# EAGLE schematic 14145^2 (EAGLE 7.5.0)
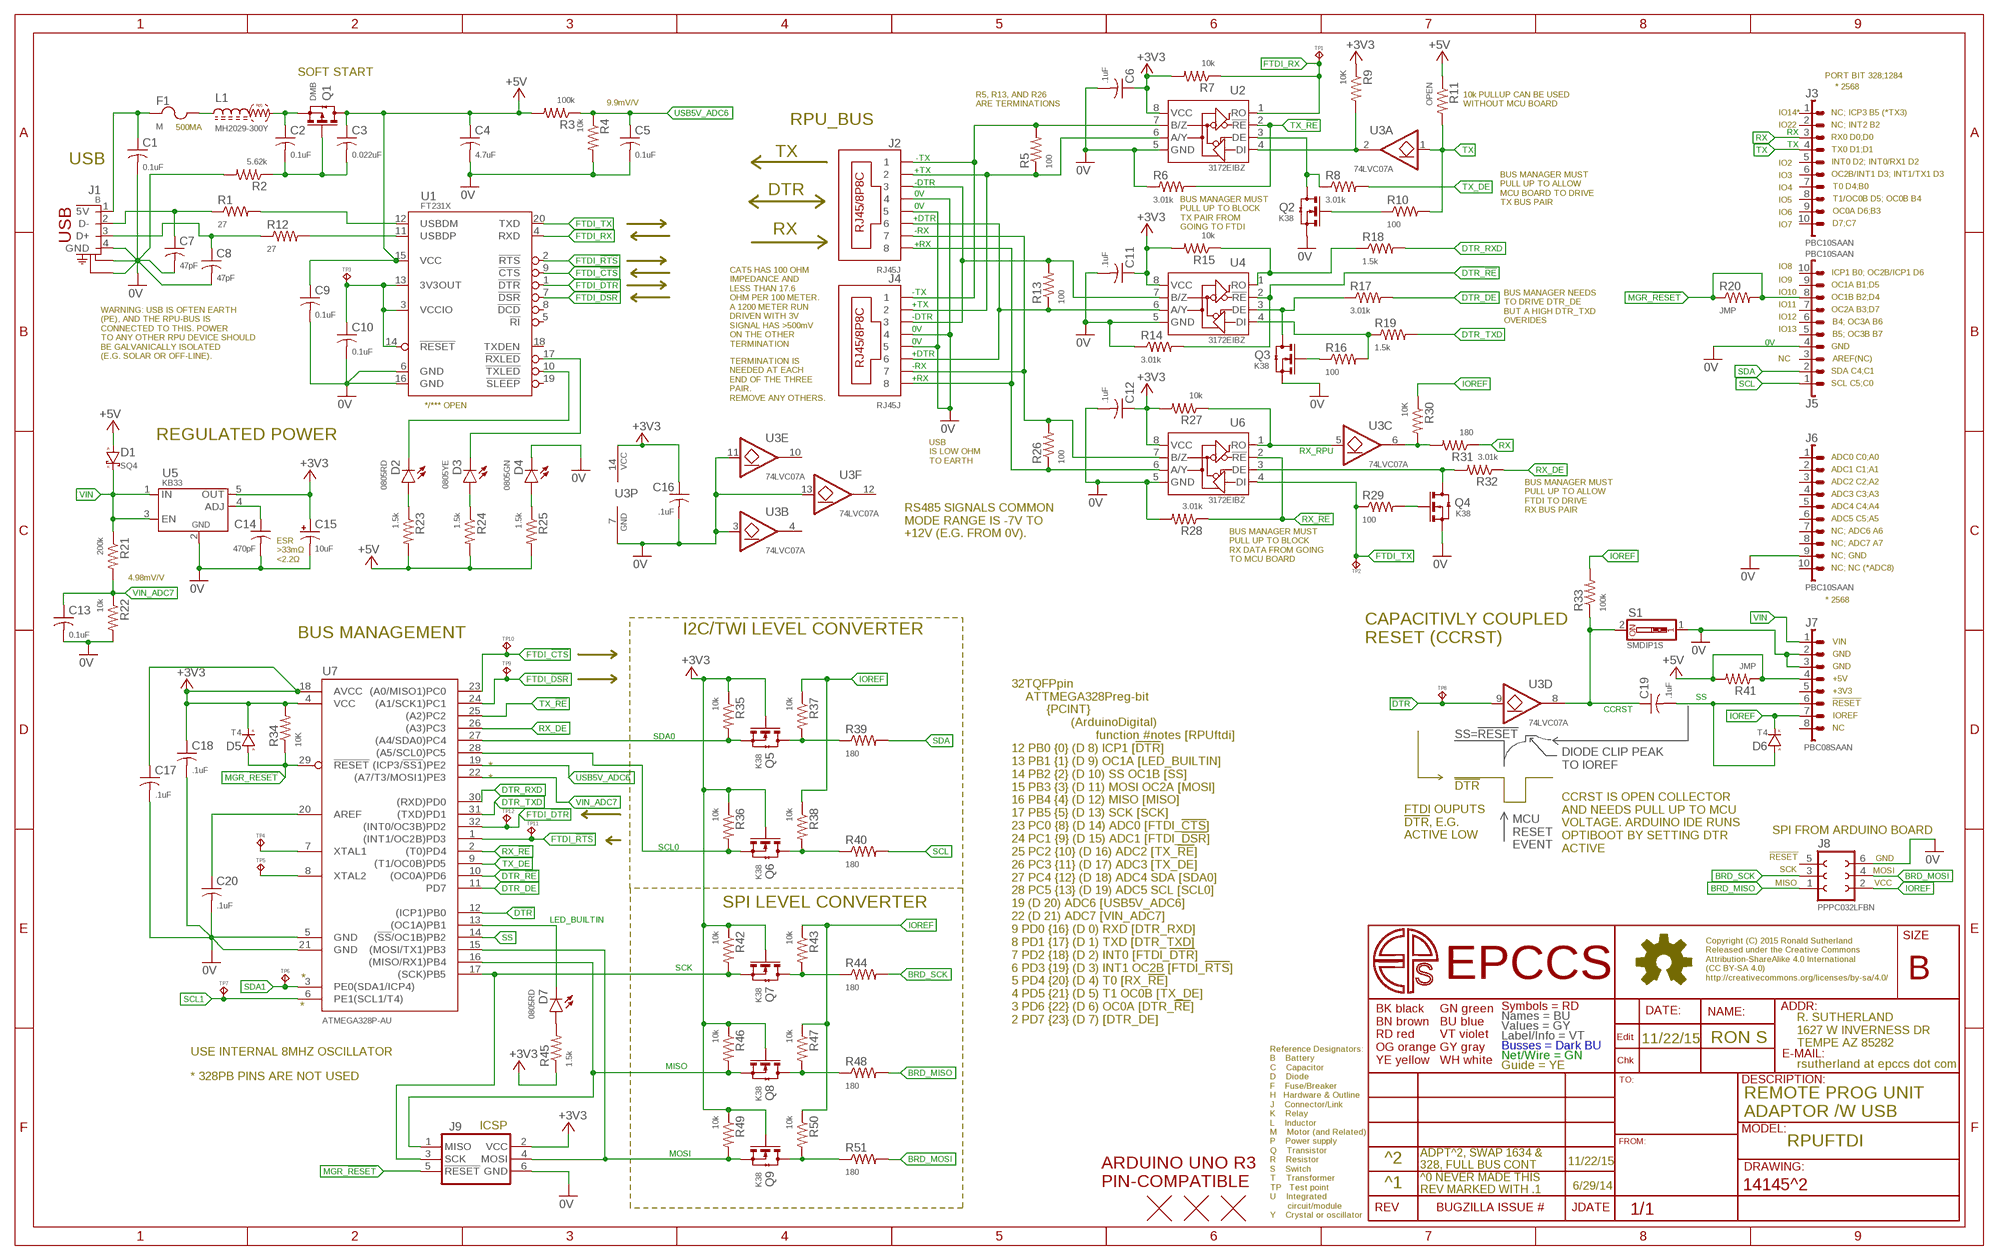
[diagram p0: schematic, sheet 1]

## Parts
C1  0.1uF  CC0603A  [C0603(1608)]
C2  0.1uF  CC0603A  [C0603(1608)]
C3  0.022uF  CC0603A  [C0603(1608)]
C4  4.7uF  CC1206  [C1206(3216)]
C5  0.1uF  CC0603A  [C0603(1608)]
C6  .1uF  CC0603A  [C0603(1608)]
C7  47pF  CC0603A  [C0603(1608)]
C8  47pF  CC0603A  [C0603(1608)]
C9  0.1uF  CC0603A  [C0603(1608)]
C10  0.1uF  CC0603A  [C0603(1608)]
C11  .1uF  CC0603A  [C0603(1608)]
C12  .1uF  CC0603A  [C0603(1608)]
C13  0.1uF  CC0603A  [C0603(1608)]
C14  470pF  CC0603A  [C0603(1608)]
C15  10uF  CT1206  [3216]
C16  .1uF  CC0603A  [C0603(1608)]
C17  .1uF  CC0603A  [C0603(1608)]
C18  .1uF  CC0603A  [C0603(1608)]
C19  .1uF  CC0603A  [C0603(1608)]
C20  .1uF  CC0603A  [C0603(1608)]
D1  SQ4  DSMA  [SMA]
D2  0805RD  LEDC0805(2012)  [C0805(2012)]
D3  0805YE  LEDC0805(2012)  [C0805(2012)]
D4  0805GN  LEDC0805(2012)  [C0805(2012)]
D5  T4  DSOD123  [SOD123]
D6  T4  DSOD123  [SOD123]
D7  0805RD  LEDC0805(2012)  [C0805(2012)]
F1  M  SMD1210  [C1210(3225)]
J1  B  [USB-B-PTH]
J2  RJ45J  RJ45-8HZT  [RJ45-8HZT]
J3  PBC10SAAN  1X10"  [1X10]
J4  RJ45J  RJ45-8HZT  [RJ45-8HZT]
J5  PBC10SAAN  1X10"  [1X10]
J6  PBC10SAAN  1X10"  [1X10]
J7  PBC08SAAN  1X8"  [1X8]
J8  PPPC032LFBN  F2X3  [F2X3]
J9  ISP-SPIPTH  [ISP]
L1  MH2029-300Y  L0805  [C0805(2012)]
Q1  DMB  N-CHSOT23  [SOT23]
Q2  K38  N-CHSOT23  [SOT23]
Q3  K38  N-CHSOT23  [SOT23]
Q4  K38  N-CHSOT23  [SOT23]
Q5  K38  N-CHSOT23  [SOT23]
Q6  K38  N-CHSOT23  [SOT23]
Q7  K38  N-CHSOT23  [SOT23]
Q8  K38  N-CHSOT23  [SOT23]
Q9  K38  N-CHSOT23  [SOT23]
R1  27  R0805  [C0805(2012)]
R2  5.62k  R0805  [C0805(2012)]
R3  100k  R0805  [C0805(2012)]
R4  10k  R0805  [C0805(2012)]
R5  100  R0805  [C0805(2012)]
R6  3.01k  R0805  [C0805(2012)]
R7  10k  R0805  [C0805(2012)]
R8  3.01k  R0805  [C0805(2012)]
R9  10K  R0805  [C0805(2012)]
R10  100  R0805  [C0805(2012)]
R11  OPEN  R0805  [C0805(2012)]
R12  27  R0805  [C0805(2012)]
R13  100  R0805  [C0805(2012)]
R14  3.01k  R0805  [C0805(2012)]
R15  10k  R0805  [C0805(2012)]
R16  100  R0805  [C0805(2012)]
R17  3.01k  R0805  [C0805(2012)]
R18  1.5k  R0805  [C0805(2012)]
R19  1.5k  R0805  [C0805(2012)]
R20  JMP  R0805  [C0805(2012)]
R21  200k  R0805  [C0805(2012)]
R22  10k  R0805  [C0805(2012)]
R23  1.5k  R0805  [C0805(2012)]
R24  1.5k  R0805  [C0805(2012)]
R25  1.5k  R0805  [C0805(2012)]
R26  100  R0805  [C0805(2012)]
R27  10k  R0805  [C0805(2012)]
R28  3.01k  R0805  [C0805(2012)]
R29  100  R0805  [C0805(2012)]
R30  10K  R0805  [C0805(2012)]
R31  180  R0805  [C0805(2012)]
R32  3.01k  R0805  [C0805(2012)]
R33  100k  R0805  [C0805(2012)]
R34  10K  R0805  [C0805(2012)]
R35  10k  R0805  [C0805(2012)]
R36  10k  R0805  [C0805(2012)]
R37  10k  R0805  [C0805(2012)]
R38  10k  R0805  [C0805(2012)]
R39  180  R0805  [C0805(2012)]
R40  180  R0805  [C0805(2012)]
R41  JMP  R0805  [C0805(2012)]
R42  10k  R0805  [C0805(2012)]
R43  10k  R0805  [C0805(2012)]
R44  180  R0805  [C0805(2012)]
R45  1.5k  R0805  [C0805(2012)]
R46  10k  R0805  [C0805(2012)]
R47  10k  R0805  [C0805(2012)]
R48  180  R0805  [C0805(2012)]
R49  10k  R0805  [C0805(2012)]
R50  10k  R0805  [C0805(2012)]
R51  180  R0805  [C0805(2012)]
S1  SMDIP1S  SW_DIP-1SMD  [SMD-DIPSWITCH-1]
TP1  TPPAD1-08  [P1-08]
TP2  TPPAD1-08  [P1-08]
TP3  TPPAD1-08  [P1-08]
TP4  TPPAD1-08  [P1-08]
TP5  TPPAD1-08  [P1-08]
TP6  TPPAD1-08  [P1-08]
TP7  TPPAD1-08  [P1-08]
TP8  TPPAD1-08  [P1-08]
TP9  TPPAD1-08  [P1-08]
TP10  TPPAD1-08  [P1-08]
TP11  TPPAD1-08  [P1-08]
TP12  TPPAD1-08  [P1-08]
U1  FT231X  [20SSOP]
U2  3172EIBZ  ISL3172EIBZ  [SOIC8]
U3  74LVC07A  7407D  [14SOIC]
U4  3172EIBZ  ISL3172EIBZ  [SOIC8]
U5  KB33  MIC5205  [SOT23-5,SOT25]
U6  3172EIBZ  ISL3172EIBZ  [SOIC8]
U7  ATMEGA328P-AU  ATMEGA328PB-AU  [TQFP32-08]
U$1  ARDUINO-UNO  [ARDUINO_UNO]
U$2  FIDUCIAL1.27  [FIDUCIAL-1.27]
U$3  FIDUCIAL1.27  [FIDUCIAL-1.27]
U$4  FIDUCIAL1.27  [FIDUCIAL-1.27]

## Nets
0V: C1.2 C4.2 C5.2 C6.2 C7.2 C8.2 C9.2 C10.2 C11.2 C12.2 C13.2 C14.2 C15.- C16.2 C17.2 C18.2 C20.2 D4.K J1.4(GND) J1.S1(CHASSIS1) J1.S2(CHASSIS2) J2.4 J2.5 J4.4 J4.5 J5.4 J6.9 J7.2 J7.3 J8.6 J9.6(GND) Q2.2(S)(S) Q3.2(S)(S) Q4.2(S)(S) R2.2 R4.2 R6.1 R14.1 R22.2 R28.2 S1.1 U1.6(GND) U1.16(GND) U2.5(GND) U3.3(B:I) U3.7(P:GND) U3.11(E:I) U3.13(F:I) U4.5(GND) U5.2(GND) U6.5(GND) U7.5(GND) U7.21(GND)
!DTR!: TP8.TP U3.9(D:I) U7.12((ICP1)PB0)
+3V3: C6.1 C11.1 C12.1 C15.+ C16.1 C17.1 C18.1 D5.C(K) J9.2(VCC) Q5.1(G)(G) Q6.1(G)(G) Q7.1(G)(G) Q8.1(G)(G) Q9.1(G)(G) R7.2 R9.1 R15.2 R27.2 R34.2 R35.1 R36.1 R42.1 R45.1 R46.1 R49.1 U2.8(VCC) U3.14(P:VCC) U4.8(VCC) U5.5(OUT) U6.8(VCC) U7.4(VCC) U7.18(AVCC)
+5V: C3.1 C4.1 C9.1 D1.A J7.4 Q1.3(D)(D) R3.2 R11.1 R23.2 R24.2 R25.2 R41.1 R41.2 U1.15(VCC)
+DTR: J2.6 J4.6 R13.1 U4.6(A/Y)
+RX: J2.8 J4.8 R26.1 U6.6(A/Y)
+TX: J2.2 J4.2 R5.1 U2.6(A/Y)
-DTR: J2.3 J4.3 R13.2 U4.7(B/Z)
-RX: J2.7 J4.7 R26.2 U6.7(B/Z)
-TX: J2.1 J4.1 R5.2 U2.7(B/Z)
BRD_MISO: J8.1 R48.2
BRD_MOSI: J8.4 R51.2
BRD_SCK: J8.3 R44.2
CCRST: C19.1 R33.1 S1.2 U3.8(D:O)
D+: C8.1 J1.3(D+) R12.1
D-: C7.1 J1.2(D-) R1.1
DTR_!RE: R14.2 U4.2(!RE) U7.10((OC0A)PD6)
DTR_DE: R17.2 U7.11(PD7)
DTR_RXD: R18.2 U7.30((RXD)PD0)
DTR_TXD: R19.2 U7.31((TXD)PD1)
FT3V3: C10.1 TP3.TP U1.3(VCCIO) U1.13(3V3OUT) U1.14(!RESET!)
FTDI_!CTS: TP10.TP U1.9(!CTS!) U7.23((A0/MISO1)PC0)
FTDI_!DSR: TP9.TP U1.7(!DSR!) U7.24((A1/SCK1)PC1)
FTDI_!DTR: TP12.TP U1.1(!DTR!) U7.32((INT0/OC3B)PD2)
FTDI_!RTS: TP11.TP U1.2(!RTS!) U7.1((INT1/OC2B)PD3)
FTDI_RX: R7.1 TP1.TP U1.4(RXD) U2.1(RO)
FTDI_TX: R29.1 TP2.TP U1.20(TXD) U6.4(DI)
IOREF: D6.C(K) J7.7 J8.2 R30.1 R33.2 R37.1 R38.1 R43.1 R47.1 R50.1
LED_BUILTIN: D7.K U7.13((OC1A)PB1)
MGR_!RESET: D5.A J5.8 J9.5(!RESET) R20.1 R20.2 R34.1 U7.29(!RESET)
MISO: J9.1(MISO) Q8.2(S)(S) R46.2 U7.16((MISO/RX1)PB4)
MOSI: J9.4(MOSI) Q9.2(S)(S) R49.2 U7.15((MOSI/TX1)PB3)
N$1: Q6.3(D)(D) R38.2 R40.1
N$2: Q5.3(D)(D) R37.2 R39.1
N$3: TP4.TP U7.7(XTAL1)
N$4: C1.1 F1.1 J1.1(5V)
N$5: F1.2 L1.1
N$6: D3.A R24.1
N$7: D2.K U1.10(!TXLED)
N$8: D3.K U1.17(!RXLED)
N$9: TP5.TP U7.8(XTAL2)
N$10: R30.2 R31.2 U3.6(C:O)
N$11: Q4.3(D)(D) R32.2 U6.3(DE)
N$12: R1.2 U1.12(USBDM)
N$13: R12.2 U1.11(USBDP)
N$14: D4.A R25.1
N$15: Q2.1(G)(G) R10.1
N$16: D2.A R23.1
N$18: Q2.3(D)(D) R8.1 U2.3(DE)
N$19: R15.1 R18.1 U4.1(RO)
N$20: Q3.3(D)(D) R17.1 U4.3(DE)
N$21: R16.2 R19.1 U4.4(DI)
N$22: Q3.1(G)(G) R16.1
N$23: Q7.3(D)(D) R43.2 R44.1
N$24: C14.1 U5.4(ADJ)
N$25: Q4.1(G)(G) R29.2
N$26: C2.1 L1.2 Q1.2(S)(S)
N$27: C2.2 C3.2 Q1.1(G)(G) R2.1
N$29: D7.A R45.2
N$30: Q9.3(D)(D) R50.2 R51.1
N$33: Q8.3(D)(D) R47.2 R48.1
RPU_AREF: C20.1 U7.20(AREF)
RX: J3.3 R31.1
RX_!RE: R28.1 U6.2(!RE) U7.2((T0)PD4)
RX_DE: R32.1 U7.26((A3)PC3)
RX_RPU: R27.1 U3.5(C:I) U6.1(RO)
SCK: J9.3(SCK) Q7.2(S)(S) R42.2 U7.17((SCK)PB5)
SCL: J5.1 R40.2
SCL0: Q6.2(S)(S) R36.2 U7.28((A5/SCL0)PC5)
SCL1: TP7.TP U7.6(PE1(SCL1/T4))
SDA: J5.2 R39.2
SDA0: Q5.2(S)(S) R35.2 U7.27((A4/SDA0)PC4)
SDA1: TP6.TP U7.3(PE0(SDA1/ICP4))
SS: C19.2 D6.A J7.6 U7.14((!SS!/OC1B)PB2)
TX: J3.4 R10.2 R11.2 U3.1(A:I)
TX_!RE: R6.2 U2.2(!RE) U7.25((A2)PC2)
TX_DE: R8.2 U7.9((T1/OC0B)PD5)
TX_RPU: R9.2 U2.4(DI) U3.2(A:O)
USB5V_ADC6: C5.1 R3.1 R4.1 U7.19((ICP3/!SS1!)PE2)
VIN: D1.K J7.1 R21.1 U5.1(IN) U5.3(EN)
VIN_ADC7: C13.1 R21.2 R22.1 U7.22((A7/T3/MOSI1)PE3)
Unconnected: J3.1 J3.2 J3.5 J3.6 J3.7 J3.8 J3.9 J3.10 J5.3 J5.5 J5.6 J5.7 J5.9 J5.10 J6.1 J6.2 J6.3 J6.4 J6.5 J6.6 J6.7 J6.8 J6.10 J7.5 J7.8 J8.5 U1.5(!RI!) U1.8(!DCD!) U1.18(TXDEN) U1.19(!SLEEP) U3.4(B:O) U3.10(E:O) U3.12(F:O)

## Notes on the sheet
- SOFT START
- PORT BIT 328;1284
- * 2568
- 9.9mV/V
- R5, R13, AND R26
  ARE TERMINATIONS
- 10k PULLUP CAN BE USED 
  WITHOUT MCU BOARD
- IO14* | NC; ICP3 B5 (*TX3)
- RPU_BUS | IO22 | NC; INT2 B2
- 500MA
- RX0 D0;D0
- TX0 D1;D1
- TX
- USB | IO2 | INT0 D2; INT0/RX1 D2
- IO3 | OC2B/INT1 D3; INT1/TX1 D3
- IO4 | T0 D4;B0
- DTR
- IO5 | T1/OC0B D5; OC0B B4
- BUS MANAGER MUST
  PULL UP TO ALLOW 
  MCU BOARD TO DRIVE
  TX BUS PAIR
- IO6 | OC0A D6;B3
- IO7 | D7;C7
- BUS MANAGER MUST
  PULL UP TO BLOCK 
  TX PAIR FROM 
  GOING TO FTDI
- RX
- IO8
- ICP1 B0; OC2B/ICP1 D6
- IO9
- OC1A B1;D5
- IO10
- OC1B B2;D4
- IO11
- OC2A B3;D7
- IO12
- BUS MANAGER NEEDS
  TO DRIVE DTR_DE
  BUT A HIGH DTR_TXD
  OVERIDES
- B4; OC3A B6
- IO13
- B5; OC3B B7
- CAT5 HAS 100 OHM 
  IMPEDANCE AND 
  LESS THAN 17.6 
  OHM PER 100 METER. 
  A 1200 METER RUN
  DRIVEN WITH 3V 
  SIGNAL HAS >500mV
  ON THE OTHER
  TERMINATION
- GND
- WARNING: USB IS OFTEN EARTH 
  (PE), AND THE RPU-BUS IS 
  CONNECTED TO THIS. POWER 
  TO ANY OTHER RPU DEVICE SHOULD
  BE GALVANICALLY ISOLATED 
  (E.G. SOLAR OR OFF-LINE).
- NC | AREF(NC)
- SDA C4;C1
- SCL C5;C0
- TERMINATION IS 
  NEEDED AT EACH
  END OF THE THREE 
  PAIR.
  REMOVE ANY OTHERS.
- */*** OPEN
- REGULATED POWER
- ADC0 C0;A0
- USB
  IS LOW OHM
  TO EARTH
- ADC1 C1;A1
- ADC2 C2;A2
- ADC3 C3;A3
- ADC4 C4;A4
- BUS MANAGER MUST
  PULL UP TO ALLOW 
  FTDI TO DRIVE
  RX BUS PAIR
- ADC5 C5;A5
- NC; ADC6 A6
- RS485 SIGNALS COMMON 
  MODE RANGE IS -7V TO 
  +12V (E.G. FROM 0V).
- NC; ADC7 A7
- NC; GND
- ESR
  >33mΩ
  <2.2Ω
- BUS MANAGER MUST
  PULL UP TO BLOCK 
  RX DATA FROM GOING
  TO MCU BOARD
- NC; NC (*ADC8)
- 4.98mV/V
- * 2568
- BUS MANAGEMENT | I2C/TWI LEVEL CONVERTER
- CAPACITIVLY COUPLED 
  RESET (CCRST)
- VIN
- GND
- GND
- +5V
- +3V3
- !RESET
- IOREF
- NC
- SS=!RESET!
- DIODE CLIP PEAK 
  TO IOREF
- *
- *
- !DTR!
- SPI FROM ARDUINO BOARD
- FTDI OUPUTS
  !DTR!, E.G.
  ACTIVE LOW
- MCU
  RESET
  EVENT
- CCRST IS OPEN COLLECTOR
  AND NEEDS PULL UP TO MCU 
  VOLTAGE. ARDUINO IDE RUNS
  OPTIBOOT BY SETTING DTR
  ACTIVE
- !RESET
- GND
- SCK
- MOSI
- MISO
- VCC
- SPI LEVEL CONVERTER
- *
- *
- 32TQFPpin
      ATTMEGA328Preg-bit
            {PCINT}
                   (ArduinoDigital)
                          function #notes [RPUftdi]
  12 PB0 {0} (D 8) ICP1 [!DTR!]
  13 PB1 {1} (D 9) OC1A [LED_BUILTIN]
  14 PB2 {2} (D 10) SS OC1B [SS]
  15 PB3 {3} (D 11) MOSI OC2A [MOSI]
  16 PB4 {4} (D 12) MISO [MISO]
  17 PB5 {5} (D 13) SCK [SCK]
  23 PC0 {8} (D 14) ADC0 [FTDI_!CTS!]
  24 PC1 {9} (D 15) ADC1 [FTDI_!DSR!]
  25 PC2 {10} (D 16) ADC2 [TX_!RE!]
  26 PC3 {11} (D 17) ADC3 [TX_DE]
  27 PC4 {12} (D 18) ADC4 SDA [SDA0]
  28 PC5 {13} (D 19) ADC5 SCL [SCL0]
  19 (D 20) ADC6 [USB5V_ADC6]
  22 (D 21) ADC7 [VIN_ADC7]
  9 PD0 {16} (D 0) RXD [DTR_RXD]
  8 PD1 {17} (D 1) TXD [DTR_TXD]
  7 PD2 {18} (D 2) INT0 [FTDI_!DTR!]
  6 PD3 {19} (D 3) INT1 OC2B [FTDI_!RTS!]
  5 PD4 {20} (D 4) T0 [RX_!RE!]
  4 PD5 {21} (D 5) T1 OC0B [TX_DE]
  3 PD6 {22} (D 6) OC0A [DTR_!RE!]
  2 PD7 {23} (D 7) [DTR_DE]
- 11/22/15 | RON S
- USE INTERNAL 8MHZ OSCILLATOR
- * 328PB PINS ARE NOT USED
- REMOTE PROG UNIT
  ADAPTOR /W USB
- ICSP
- RPUFTDI
- ^2 | 11/22/15
- ADPT^2, SWAP 1634 &
  328, FULL BUS CONT
- ^1 | 6/29/14
- ^0 NEVER MADE THIS
  REV MARKED WITH .1

## Library data of the parts
C1-C14 C16-C20 = C-C:C: CAPACITOR Symbol
C15 = C-T:CT: Tantalum Electrolytic Capacitor
D1 = D-SBR:D: DIODE
D2-D4 D7 = D-LED:LED: LED 120120WH [CREE,XHGAWT-00-0000-00000HXE1] LED WHITE 6500K 150LUM-W120120
D5 D6 = D-GP:D: DIODE
F1 = F-RST:SMD: Fuse i.e. Bourns, MF-USMF075-2
J1 = J-USB:B: B [MOLEX,0670688000] USB B THROUGH HOLE
J2 J4 = J-RJ45:RJ45-8: RJ45 Jack RJ45J [ASSMANN,A-2014-2-4-R] JACK MODULAR VERT PCB 8P8C UNSHIELD Horz version form sparkfun sku PRT-00643, and breakout board sku is BOB-00716.
J3 J5 J6 = J-HDR2.54mm:1X10: 10 POS HEADER PBC10S [SULLINS,PBC10SAAN]HEADER MALE BRKWAY 10POS .1IN AA
J7 = J-HDR2.54mm:1X8: 8 POS HEADER PBC08SAAN [SULLINS,PBC08SAAN]HEADER MALE BRKWAY 8POS .1IN AA
J8 = J-HDR2.54mm:F2X3: FEMALE HEADER 2X3POS
J9 = U-AVR:ISP-SPI: AVR ISP thru SPI In-System Programming uses the target Atmel AVR’s internal SPI (Serial Peripheral Interface) to download code into the flash and EEPROM memories. It is not a debugging interface. When designing an application PCB which includes an AVR with the SPI interface, this pinout should be used. Sparkfun SKU: BOB-08508
L1 = L-FB:L: Ferrite Bead with frequency dependent resistance
Q1 = Q-PCH:N-CH?*: ENHANCEMENT MODE MOSFET SOT23 is BSS138 pinout
Q2-Q9 = Q-NCH:N-CH?*: ENHANCEMENT MODE MOSFET SOT23 is BSS138 pinout
R1-R51 = R-C:R: Resiistor American-style symbol
S1 = S-Toggle:SW_DIP-1
TP1-TP12 = J-TP:TP: Test pad
U1 = U-Transceiver:FT231X
U2 U4 U6 = U-Transceiver:ISL3172E: TRANSCEIVER RS485 3.3V HALFDPLX
U3 = U-7400:74*07: HEX BUFFER, OPEN DRAIN/COLLECTOR 74LVC07A [DIODES,74LVC07AS14-13] LOGIC BUFFER OPEN DRAIN 14SOIC
U5 = P-DCDC:MIC5205: KB33 [MICREL,MIC5205-3.3YM5] REG ULDO 3V3 150MA SOT23-5
U7 = U-AVR:ATMEGA328PB-AU: ATmega328PB 4 Kbytes FLASH 128 bytes SRAM 256 bytes EEPROM 2 UART, 2 I2C, 2 SPI 8-channel 10 bit ADC
U$1 = J-BoardHDR:ARDUINO-UNO: Board Outline with holes and silk note the board dim layer is not defined
U$2-U$4 = H-Fiducial:FIDUCIAL: Fiducial Alignment Points Various fiducial points for machine vision alignment.

## Net classes
0 default: width 0.254 mm, drill 0.33 mm